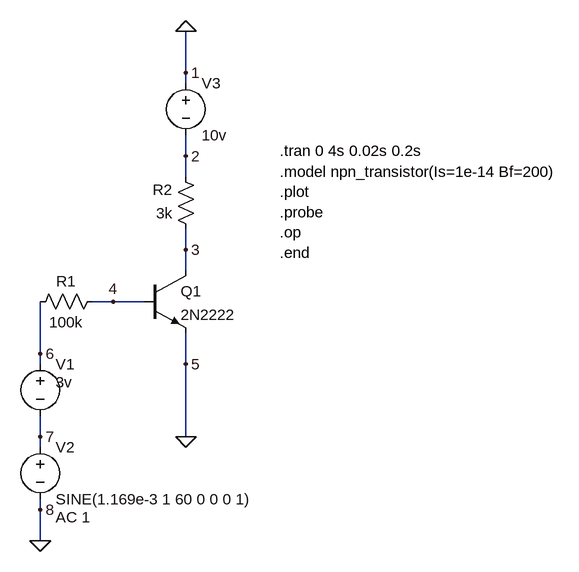
[diagram p0: schematic ques4.6.asc]
ques4.6.asc, the LTspice schematic file:
Version 4
SHEET 1 976 680
WIRE 384 -112 384 -176
WIRE 384 -96 384 -112
WIRE 384 16 384 -16
WIRE 384 48 384 16
WIRE 384 160 384 128
WIRE 384 192 384 160
WIRE 272 240 240 240
WIRE 320 240 272 240
WIRE 160 320 160 240
WIRE 160 336 160 320
WIRE 384 336 384 288
WIRE 160 448 160 416
WIRE 384 448 384 336
WIRE 160 464 160 448
WIRE 160 560 160 544
WIRE 160 608 160 560
FLAG 384 448 0
FLAG 160 608 0
FLAG 384 -176 0
FLAG 384 -112 1
FLAG 384 16 2
FLAG 384 160 3
FLAG 272 240 4
FLAG 384 336 5
FLAG 160 448 7
FLAG 160 320 6
FLAG 160 560 8
SYMBOL res 256 224 R90
WINDOW 0 0 56 VBottom 2
WINDOW 3 32 56 VTop 2
SYMATTR InstName R1
SYMATTR Value 100k
SYMBOL res 400 144 R180
WINDOW 0 36 76 Left 2
WINDOW 3 36 40 Left 2
SYMATTR InstName R2
SYMATTR Value 3k
SYMBOL voltage 160 320 R0
WINDOW 3 24 44 Left 2
WINDOW 123 0 0 Left 2
WINDOW 39 0 0 Left 2
SYMATTR Value 3v
SYMATTR InstName V1
SYMBOL npn 320 192 R0
SYMATTR InstName Q1
SYMATTR Value 2N2222
SYMBOL voltage 160 448 R0
WINDOW 123 24 124 Left 2
WINDOW 39 0 0 Left 2
SYMATTR Value2 AC 1
SYMATTR InstName V2
SYMATTR Value SINE(1.169e-3 1 60 0 0 0 1)
SYMBOL voltage 384 -112 R0
WINDOW 123 0 0 Left 2
WINDOW 39 0 0 Left 2
SYMATTR InstName V3
SYMATTR Value 10v
TEXT 528 40 Left 2 !.model npn_transistor(Is=1e-14 Bf=200)\n.plot\n.probe\n.op\n.end
TEXT 528 8 Left 2 !.tran 0 4s 0.02s 0.2s

The netlist it stands for:
* ques4.6.asc
R1 4 6 100k
R2 3 2 3k
V1 6 7 3v
Q1 3 4 0 0 2N2222
V2 7 0 SINE(1.169e-3 1 60 0 0 0 1) AC 1
V3 0 2 10v
.model NPN NPN
.model PNP PNP
.lib standard.bjt
.model npn_transistor(Is=1e-14 Bf=200)
.plot
.probe
.op
.end
.tran 0 4s 0.02s 0.2s
.backanno
.end